# EAGLE schematic Timelapse_camera_RevB (EAGLE 7.2.0)
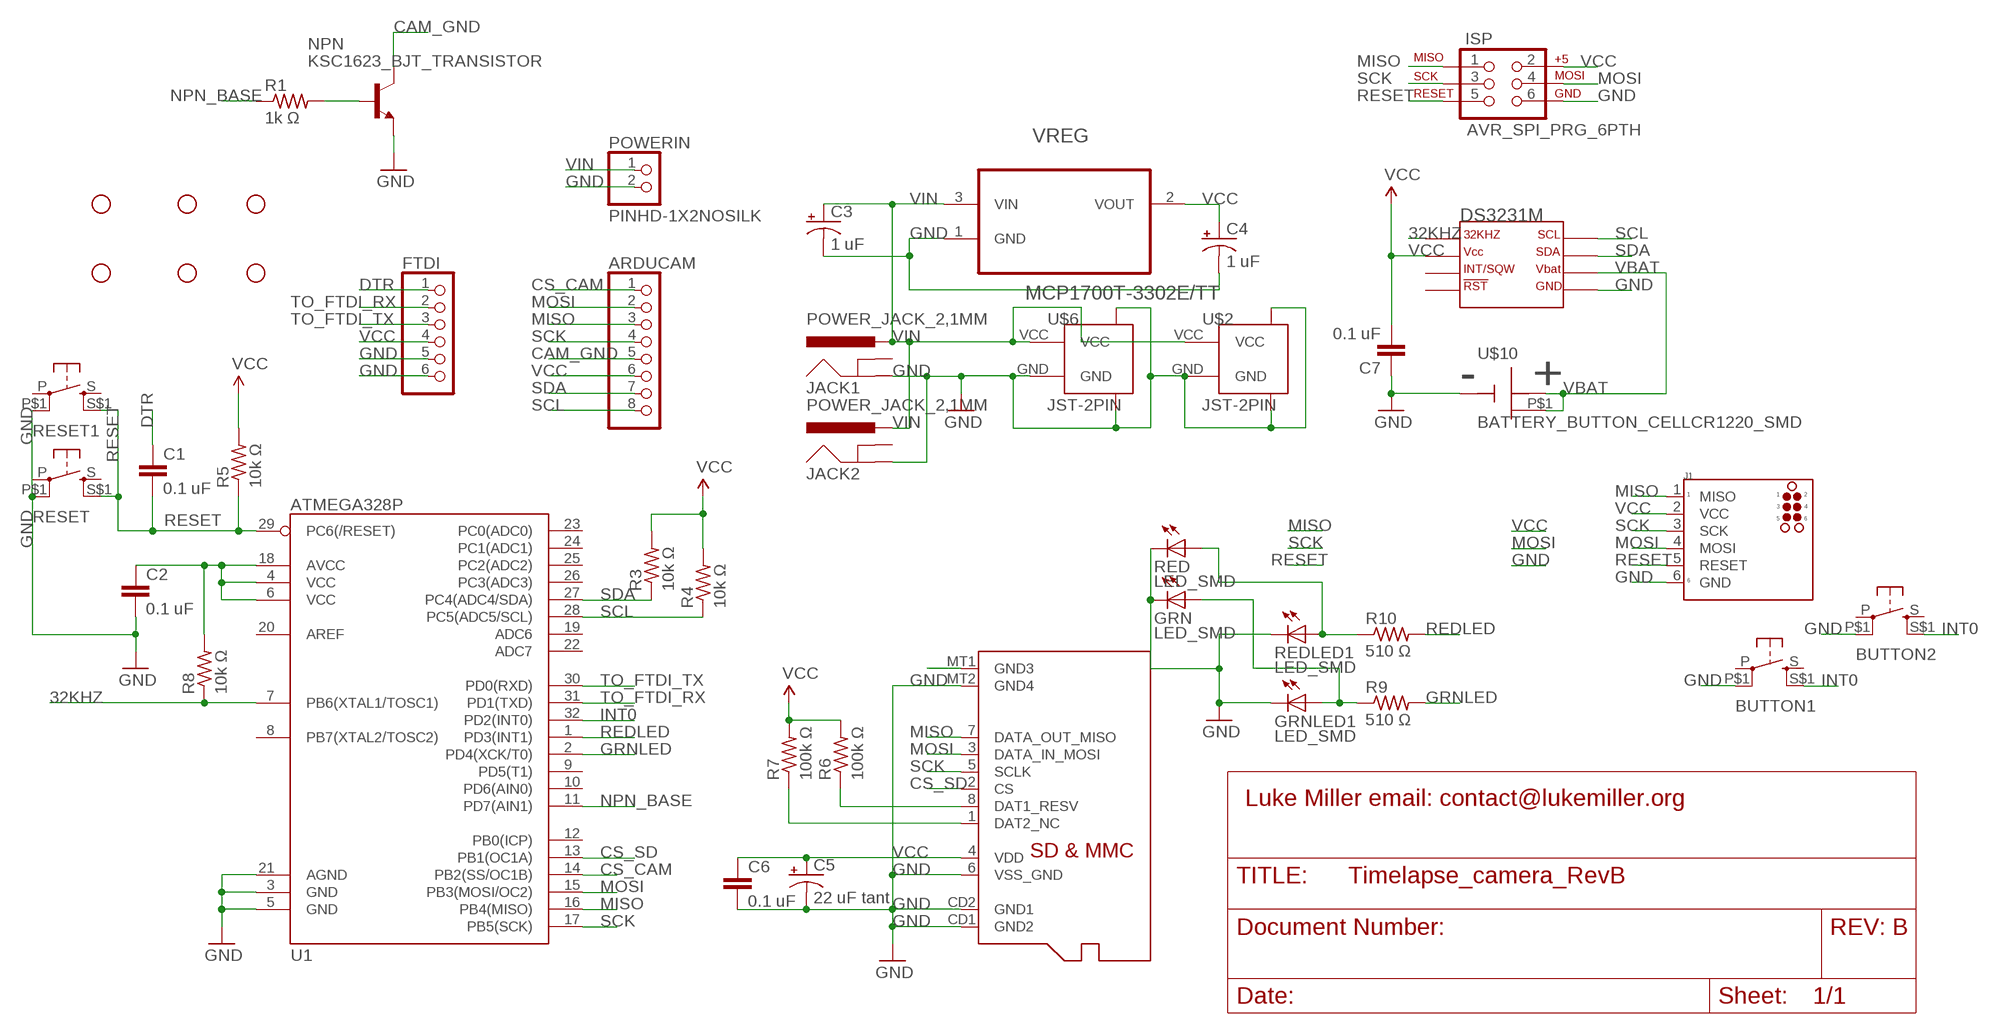
[diagram p0: schematic, sheet 1]

## Parts
ARDUCAM  PINHD-1X8RIGHTANGLE_FEMALE  [1X08-RA]
BUTTON1  PUSHBUTTON_DPST_SMDSTANDARD  [PUSHBUTTON_DPST_SMD]
BUTTON2  PUSHBUTTON_DPST_SMDSTANDARD  [PUSHBUTTON_DPST_SMD]
C1  0.1 uF  CAP0805  [0805]
C2  0.1 uF  CAP0805  [0805]
C3  1 uF  CPOL-USB  [PANASONIC_B]
C4  1 uF  CPOL-USB  [PANASONIC_B]
C5  22 uF tant  CPOL-US0805  [C0805_POL]
C6  0.1 uF  CAP0805  [0805]
C7  0.1 uF  CAP0805  [0805]
DS3231M  DS3231MSOIC-8  [DS3231M_SOIC8]
FTDI  PINHD-1X6CB  [1X06-CLEANBIG]
GRN  LED_SMD  [CHIPLED_0805]
GRNLED1  LED_SMD  [CHIPLED_0805]
ISP  AVR_SPI_PRG_6PTH  [2X3]
J1  TC2030-MCP-NL  [TC2030-MCP-NL]
JACK1  POWER_JACK_2,1MM  [POWER_JACK_DC_2,1MM]
JACK2  POWER_JACK_2,1MM  [POWER_JACK_DC_2,1MM]
NPN  KSC1623_BJT_TRANSISTOR  [SOT23]
POWERIN  PINHD-1X2NOSILK  [1X02_NOSILK]
R1  1k Ω  RESISTOR_SMDR0805  [R0805]
R3  10k Ω  RESISTOR_SMDR0805  [R0805]
R4  10k Ω  RESISTOR_SMDR0805  [R0805]
R5  10k Ω  RESISTOR_SMDR0805  [R0805]
R6  100k Ω  RESISTOR_SMDR0805  [R0805]
R7  100k Ω  RESISTOR_SMDR0805  [R0805]
R8  10k Ω  RESISTOR_SMDR0805  [R0805]
R9  510 Ω  RESISTOR_SMDR0805  [R0805]
R10  510 Ω  RESISTOR_SMDR0805  [R0805]
RED  LED_SMD  [CHIPLED_0805]
REDLED1  LED_SMD  [CHIPLED_0805]
RESET  PUSHBUTTON_DPST_SMDSTANDARD  [PUSHBUTTON_DPST_SMD]
RESET1  PUSHBUTTON_DPST_SMDSTANDARD  [PUSHBUTTON_DPST_SMD]
STANDOFF1  STAND-OFF  [STAND-OFF]
STANDOFF2  STAND-OFF  [STAND-OFF]
STANDOFF3  STAND-OFF  [STAND-OFF]
STANDOFF4  STAND-OFF  [STAND-OFF]
STANDOFF5  STAND-OFF  [STAND-OFF]
STANDOFF6  STAND-OFF  [STAND-OFF]
U1  ATMEGA328P  ATMEGA328_SMT  [TQFP32-08]
U$2  JST-2PIN  [JST-2-SMD-VERT]
U$3  MICROSD  [MICROSD]
U$6  JST-2PIN  [JST-2-SMD-VERT]
U$10  BATTERY_BUTTON_CELLCR1220_SMD  [CR1220_BATTERY_HOLDER_SMD]
VREG  MCP1700T-3302E/TT  [SOT95P237X112-3N]

## Nets
32KHZ: DS3231M.1(P$1_32KHZ) R8.1 U1.7(PB6(XTAL1/TOSC1))
CAM_GND: ARDUCAM.5 NPN.3(C)
CD1: U$3.MT1(GND3)
CS_CAM: ARDUCAM.1 U1.14(PB2(SS/OC1B))
CS_SD: U1.13(PB1(OC1A)) U$3.2(CS)
DTR: C1.1 FTDI.1
GND: BUTTON1.P$1(P1) BUTTON2.P$1(P1) C2.2 C3.- C4.- C5.P$2_C(-) C6.2 C7.1 DS3231M.5(P$5_GND) FTDI.5 FTDI.6 GRN.C GRNLED1.C ISP.6 J1.6(GND) JACK1.P$2(GND) JACK2.P$2(GND) NPN.2(E) POWERIN.2 RED.C REDLED1.C RESET1.P$1(P1) RESET.P$1(P1) U1.3(GND) U1.5(GND) U1.21(AGND) U$2.GND U$2.P$1(BODY1) U$2.P$2(BODY2) U$3.6(VSS_GND) U$3.CD1(GND2) U$3.CD2(GND1) U$3.MT2(GND4) U$6.GND U$6.P$1(BODY1) U$6.P$2(BODY2) U$10.GND VREG.1(GND)
GRNLED: R9.2 U1.2(PD4(XCK/T0))
INT0: BUTTON1.S$1(S1) BUTTON2.S$1(S1) U1.32(PD2(INT0))
MISO: ARDUCAM.3 ISP.1 J1.1(MISO) U1.16(PB4(MISO)) U$3.7(DATA_OUT_MISO)
MOSI: ARDUCAM.2 ISP.4 J1.4(MOSI) U1.15(PB3(MOSI/OC2)) U$3.3(DATA_IN_MOSI)
N$1: NPN.1(B) R1.2
N$2: R7.1 U$3.1(DAT2_NC)
N$3: R6.1 U$3.8(DAT1_RESV)
N$8: GRN.A GRNLED1.A R9.1
N$9: R10.1 RED.A REDLED1.A
NPN_BASE: R1.1 U1.11(PD7(AIN1))
REDLED: R10.2 U1.1(PD3(INT1))
RESET: C1.2 ISP.5 J1.5(RESET) R5.1 RESET1.S$1(S1) RESET.S$1(S1) U1.29(PC6(/RESET))
SCK: ARDUCAM.4 ISP.3 J1.3(SCK) U1.17(PB5(SCK)) U$3.5(SCLK)
SCL: ARDUCAM.8 DS3231M.8(P$8_SCL) R4.1 U1.28(PC5(ADC5/SCL))
SDA: ARDUCAM.7 DS3231M.7(P$7_SDA) R3.1 U1.27(PC4(ADC4/SDA))
TO_FTDI_RX: FTDI.2 U1.31(PD1(TXD))
TO_FTDI_TX: FTDI.3 U1.30(PD0(RXD))
VBAT: DS3231M.6(P$6_VBAT) U$10.P$1(P$2_VBAT) U$10.P$2(VBAT)
VCC: ARDUCAM.6 C2.1 C4.+ C5.P$1_A(+) C6.1 C7.2 DS3231M.2(P$2_VCC) FTDI.4 ISP.2 J1.2(VCC) R3.2 R4.2 R5.2 R6.2 R7.2 R8.2 U1.4(VCC) U1.6(VCC) U1.18(AVCC) U$3.4(VDD) VREG.2(VOUT)
VIN: C3.+ JACK1.P$1(PWR) JACK2.P$1(PWR) POWERIN.1 U$2.VCC U$6.VCC VREG.3(VIN)
Unconnected: BUTTON1.P BUTTON1.S BUTTON2.P BUTTON2.S DS3231M.3(P$3_INT) DS3231M.4(P$4_RST) JACK1.P$3(GNDBREAK) JACK2.P$3(GNDBREAK) RESET1.P RESET1.S RESET.P RESET.S U1.8(PB7(XTAL2/TOSC2)) U1.9(PD5(T1)) U1.10(PD6(AIN0)) U1.12(PB0(ICP)) U1.19(ADC6) U1.20(AREF) U1.22(ADC7) U1.23(PC0(ADC0)) U1.24(PC1(ADC1)) U1.25(PC2(ADC2)) U1.26(PC3(ADC3))

## Library data of the parts
ARDUCAM = miller:PINHD-1X8: PIN HEADER
BUTTON1 BUTTON2 RESET RESET1 = miller:PUSHBUTTON_DPST_SMD: PUSHBUTTON DPST SMD Omron B3S-1000 Digikey PN SW836CT-ND This is your standard "hobbyist" style momentary pushbutton in a surface mount package.
C1 C2 C6 C7 = miller:CAP: Capacitor Standard surface mount ceramic capacitor and 0.1" leaded capacitor.
C3-C5 = miller:CPOL-US: POLARIZED CAPACITOR, American symbol
DS3231M = miller:DS3231M: DS3231M real time clock Battery backup, 2.3V to 5.5V supply voltage 1Hz and 32.768kHz outputs NOTE: This is a slightly lower cost version of the regular DS3231S, with fewer clock frequency output options and slightly lower long-term time accuracy. It uses the same I2C communications protocol as the DS3231S, and is available in a small SOIC-8 package or Wide SOIC-16 (0.300") package. Maxim PN DS3231MZ+ SOIC-8 package Maxim PN DS3231M+ SOIC-16 Wide package
FTDI = miller:PINHD-1X6: PIN HEADER
GRN GRNLED1 RED REDLED1 = miller:LED_SMD: LED surface mount 0805
ISP = miller:AVR_SPI_PRG_6: AVR ISP 6 Pin This is the reduced ISP connector for AVR programming. Common on Arduino. This footprint will take up less PCB space and can be used with a 10-pin to 6-pin adapter such as SKU: BOB-08508 **Special note about "TEST_POINT" package. The stop mask is on the top side, so if you want your programming test points to be on the bottom of your board, make sure to place this package on the bottom side of the board. This also ensure that the orientation to program from the bottom side will be correct.
J1 = miller:TC2030: TAG-CONNECT ICSP Connector Manufacturer: Tag-Connect <http://www.tag-connect.com> Cable for easy In-Circuit Serial Programming. Designed for Microchip ICD2, suitable for many others. Two variants - one "with legs" (for hands-free fit on PCB) and another "without legs" for quick programming. Pin labels changed to match AVR ICSP pinout for programming ATMEL AVR chips PAD Description 1 MCLR/Vpp 2 Vdd 3 GND 4 PGD (ISPDAT) 5 PGC (ISPCLK) 6 nc (used for LVP) ©2009 ROFA.cz - modified and updated by Robert Darlington ‹rdarlington@gmail.com›
JACK1 JACK2 = miller:POWER_JACK_2,1MM: DC Power Jack, 2.1mm center pin. Digikey PN CP-202AH-ND
NPN = miller:KSC1623_BJT_TRANSISTOR: KSC1623 BJT NPN transistor - Fairchild Seminconductor KSC1623LMTF Digikey PN KSC1623LMTFCT-ND Mouser PN 512-KSC1623LMTF
POWERIN = miller:PINHD-1X2: 1x2 pin header 0.1" spacing (2.54mm)
R1 R3-R10 = miller:RESISTOR_SMD: RESISTOR, American symbol
STANDOFF1-STANDOFF6 = miller:STAND-OFF: #4 Stand Off This is the mechanical footprint for a #4 phillips button head screw. Use the keepout ring to avoid running the screw head into surrounding components. SKU : PRT-00447
U1 = miller:ATMEGA328_SMT: 32-Pin Atmega328
U$2 U$6 = miller:JST-2PIN: JST B2B-PH-SM4-TM 2-pin connector 2.0 mm spacing surface mount, vertical entry Accepts JST PHR-2 female connectors
U$3 = miller:MICROSD: Micro-SD / Transflash card holder with SPI pinout For the 3M # 2908-05WB-MG and/or 4UCON #19656 push-push type (spring-loaded) Digikey PN 3M5607CT-ND
U$10 = miller:BATTERY_BUTTON_CELL: Coin cell battery holders Check that you choose the appropriate battery size CR1025 (10 mm) CR1220 (12 mm)
VREG = Microchip_By_element14_Batch_1:MCP1700T-3302E/TT: Low Quiescent Current LDO; MPN: MCP1700T-3302E/TT; OC_FARNELL: 1296592; OC_NEWARK: 88H9817; PACKAGE: SOT23-3; SUPPLIER: Microchip